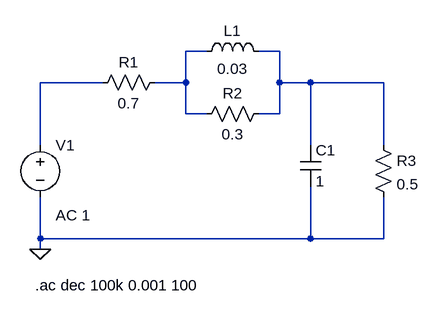
[diagram p0: schematic 4.asc]
4.asc, the LTspice schematic file:
Version 4
SHEET 1 880 740
WIRE 448 -16 416 -16
WIRE 560 -16 528 -16
WIRE 288 32 192 32
WIRE 416 32 416 -16
WIRE 416 32 368 32
WIRE 560 32 560 -16
WIRE 608 32 560 32
WIRE 720 32 608 32
WIRE 416 80 416 32
WIRE 448 80 416 80
WIRE 560 80 560 32
WIRE 560 80 528 80
WIRE 192 128 192 32
WIRE 608 128 608 32
WIRE 720 128 720 32
WIRE 192 272 192 208
WIRE 608 272 608 192
WIRE 608 272 192 272
WIRE 720 272 720 208
WIRE 720 272 608 272
WIRE 192 288 192 272
FLAG 192 288 0
SYMBOL voltage 192 112 R0
WINDOW 123 24 124 Left 2
WINDOW 39 0 0 Left 0
SYMATTR Value2 AC 1
SYMATTR InstName V1
SYMATTR Value ""
SYMBOL res 384 16 R90
WINDOW 0 0 56 VBottom 2
WINDOW 3 32 56 VTop 2
SYMATTR InstName R1
SYMATTR Value 0.7
SYMBOL res 544 64 R90
WINDOW 0 0 56 VBottom 2
WINDOW 3 32 56 VTop 2
SYMATTR InstName R2
SYMATTR Value 0.3
SYMBOL ind 432 0 R270
WINDOW 0 32 56 VTop 2
WINDOW 3 5 56 VBottom 2
SYMATTR InstName L1
SYMATTR Value 0.03
SYMBOL cap 592 128 R0
SYMATTR InstName C1
SYMATTR Value 1
SYMBOL res 704 112 R0
SYMATTR InstName R3
SYMATTR Value 0.5
TEXT 184 344 Left 2 !.ac dec 100k 0.001 100

The netlist it stands for:
* 4.asc
V1 N003 0 AC 1
R1 N001 N003 0.7
R2 N002 N001 0.3
L1 N001 N002 0.03
C1 N002 0 1
R3 N002 0 0.5
.ac dec 100k 0.001 100
.backanno
.end